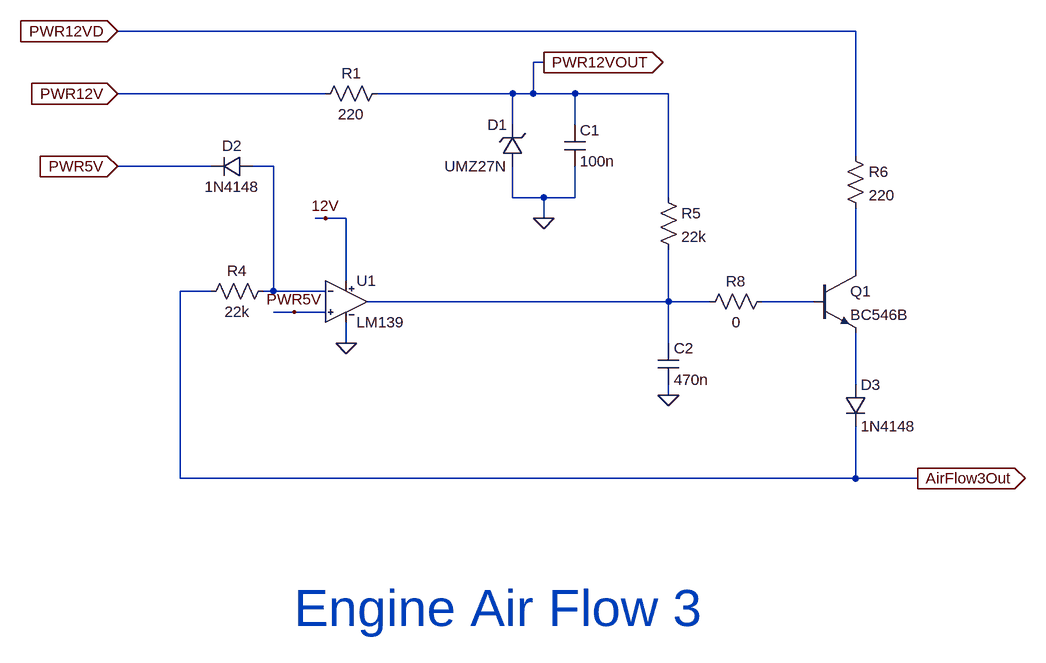
[diagram p0: schematic dme_analog_airflow.asc]
dme_analog_airflow.asc, the LTspice schematic file:
Version 4
SHEET 1 4356 3824
WIRE 272 2112 -864 2112
WIRE -208 2160 -224 2160
WIRE -544 2208 -864 2208
WIRE -256 2208 -464 2208
WIRE -224 2208 -224 2160
WIRE -224 2208 -256 2208
WIRE -160 2208 -224 2208
WIRE -16 2208 -160 2208
WIRE -256 2256 -256 2208
WIRE -160 2256 -160 2208
WIRE 272 2304 272 2112
WIRE -720 2320 -864 2320
WIRE -624 2320 -656 2320
WIRE -256 2368 -256 2320
WIRE -208 2368 -256 2368
WIRE -160 2368 -160 2320
WIRE -160 2368 -208 2368
WIRE -16 2368 -16 2208
WIRE -544 2400 -560 2400
WIRE -512 2400 -544 2400
WIRE -208 2400 -208 2368
WIRE 272 2480 272 2384
WIRE -512 2496 -512 2400
WIRE -720 2512 -768 2512
WIRE -624 2512 -624 2320
WIRE -624 2512 -640 2512
WIRE -544 2512 -624 2512
WIRE -16 2528 -16 2448
WIRE -16 2528 -480 2528
WIRE 48 2528 -16 2528
WIRE 208 2528 128 2528
WIRE -592 2544 -624 2544
WIRE -544 2544 -592 2544
WIRE -512 2592 -512 2560
WIRE -16 2592 -16 2528
WIRE 272 2656 272 2576
WIRE -16 2672 -16 2656
WIRE -768 2800 -768 2512
WIRE 272 2800 272 2720
WIRE 272 2800 -768 2800
WIRE 368 2800 272 2800
FLAG -592 2544 PWR5V
FLAG 368 2800 AirFlow3Out
IOPIN 368 2800 Out
FLAG -16 2672 0
FLAG -544 2400 12V
FLAG -512 2592 0
FLAG -864 2320 PWR5V
IOPIN -864 2320 In
FLAG -208 2400 0
FLAG -864 2208 PWR12V
IOPIN -864 2208 In
FLAG -864 2112 PWR12VD
IOPIN -864 2112 In
FLAG -208 2160 PWR12VOUT
IOPIN -208 2160 Out
SYMBOL res -624 2496 R90
WINDOW 0 0 56 VBottom 2
WINDOW 3 32 56 VTop 2
SYMATTR InstName R4
SYMATTR Value 22k
SYMBOL diode -656 2304 R90
WINDOW 0 0 32 VBottom 2
WINDOW 3 32 32 VTop 2
SYMATTR InstName D2
SYMATTR Value 1N4148
SYMBOL Res -32 2352 R0
SYMATTR InstName R5
SYMATTR Value 22k
SYMBOL Cap -32 2592 R0
SYMATTR InstName C2
SYMATTR Value 470n
SYMBOL diode 256 2656 R0
SYMATTR InstName D3
SYMATTR Value 1N4148
SYMBOL npn 208 2480 R0
SYMATTR InstName Q1
SYMATTR Value BC546B
SYMBOL Res 256 2288 R0
SYMATTR InstName R6
SYMATTR Value 220
SYMBOL Res 144 2512 R90
WINDOW 0 0 56 VBottom 2
WINDOW 3 32 56 VTop 2
SYMATTR InstName R8
SYMATTR Value 0
SYMBOL zener -240 2320 R180
WINDOW 0 24 64 Left 2
WINDOW 3 24 0 Left 2
SYMATTR InstName D1
SYMATTR Value UMZ27N
SYMBOL Cap -176 2256 R0
SYMATTR InstName C1
SYMATTR Value 100n
SYMBOL Res -448 2192 R90
WINDOW 0 0 56 VBottom 2
WINDOW 3 32 56 VTop 2
SYMATTR InstName R1
SYMATTR Value 220
SYMBOL lm139 -512 2528 R0
SYMATTR InstName U1
TEXT -592 3000 Left 6 ;Engine Air Flow 3

The netlist it stands for:
* dme_analog_airflow.asc
R4 N001 AirFlow3Out 22k
D2 N001 PWR5V 1N4148
R5 PWR12VOUT N003 22k
C2 N003 0 470n
D3 N005 AirFlow3Out 1N4148
Q1 N002 N004 N005 0 BC546B
R6 PWR12VD N002 220
R8 N004 N003 0
D1 0 PWR12VOUT UMZ27N
C1 PWR12VOUT 0 100n
R1 PWR12VOUT PWR12V 220
XU1 PWR5V N001 12V 0 N003 LM139  ; pins In+ In- V+ V- OUT
.model D D
.lib standard.dio
.model NPN NPN
.model PNP PNP
.lib standard.bjt
* Engine Air Flow 3
.lib lm139.cir
.backanno
.end